# EAGLE design OSO-MISC-20-014-Solar Spike (EAGLE 9.4.2)

## Sheet 1 of 2
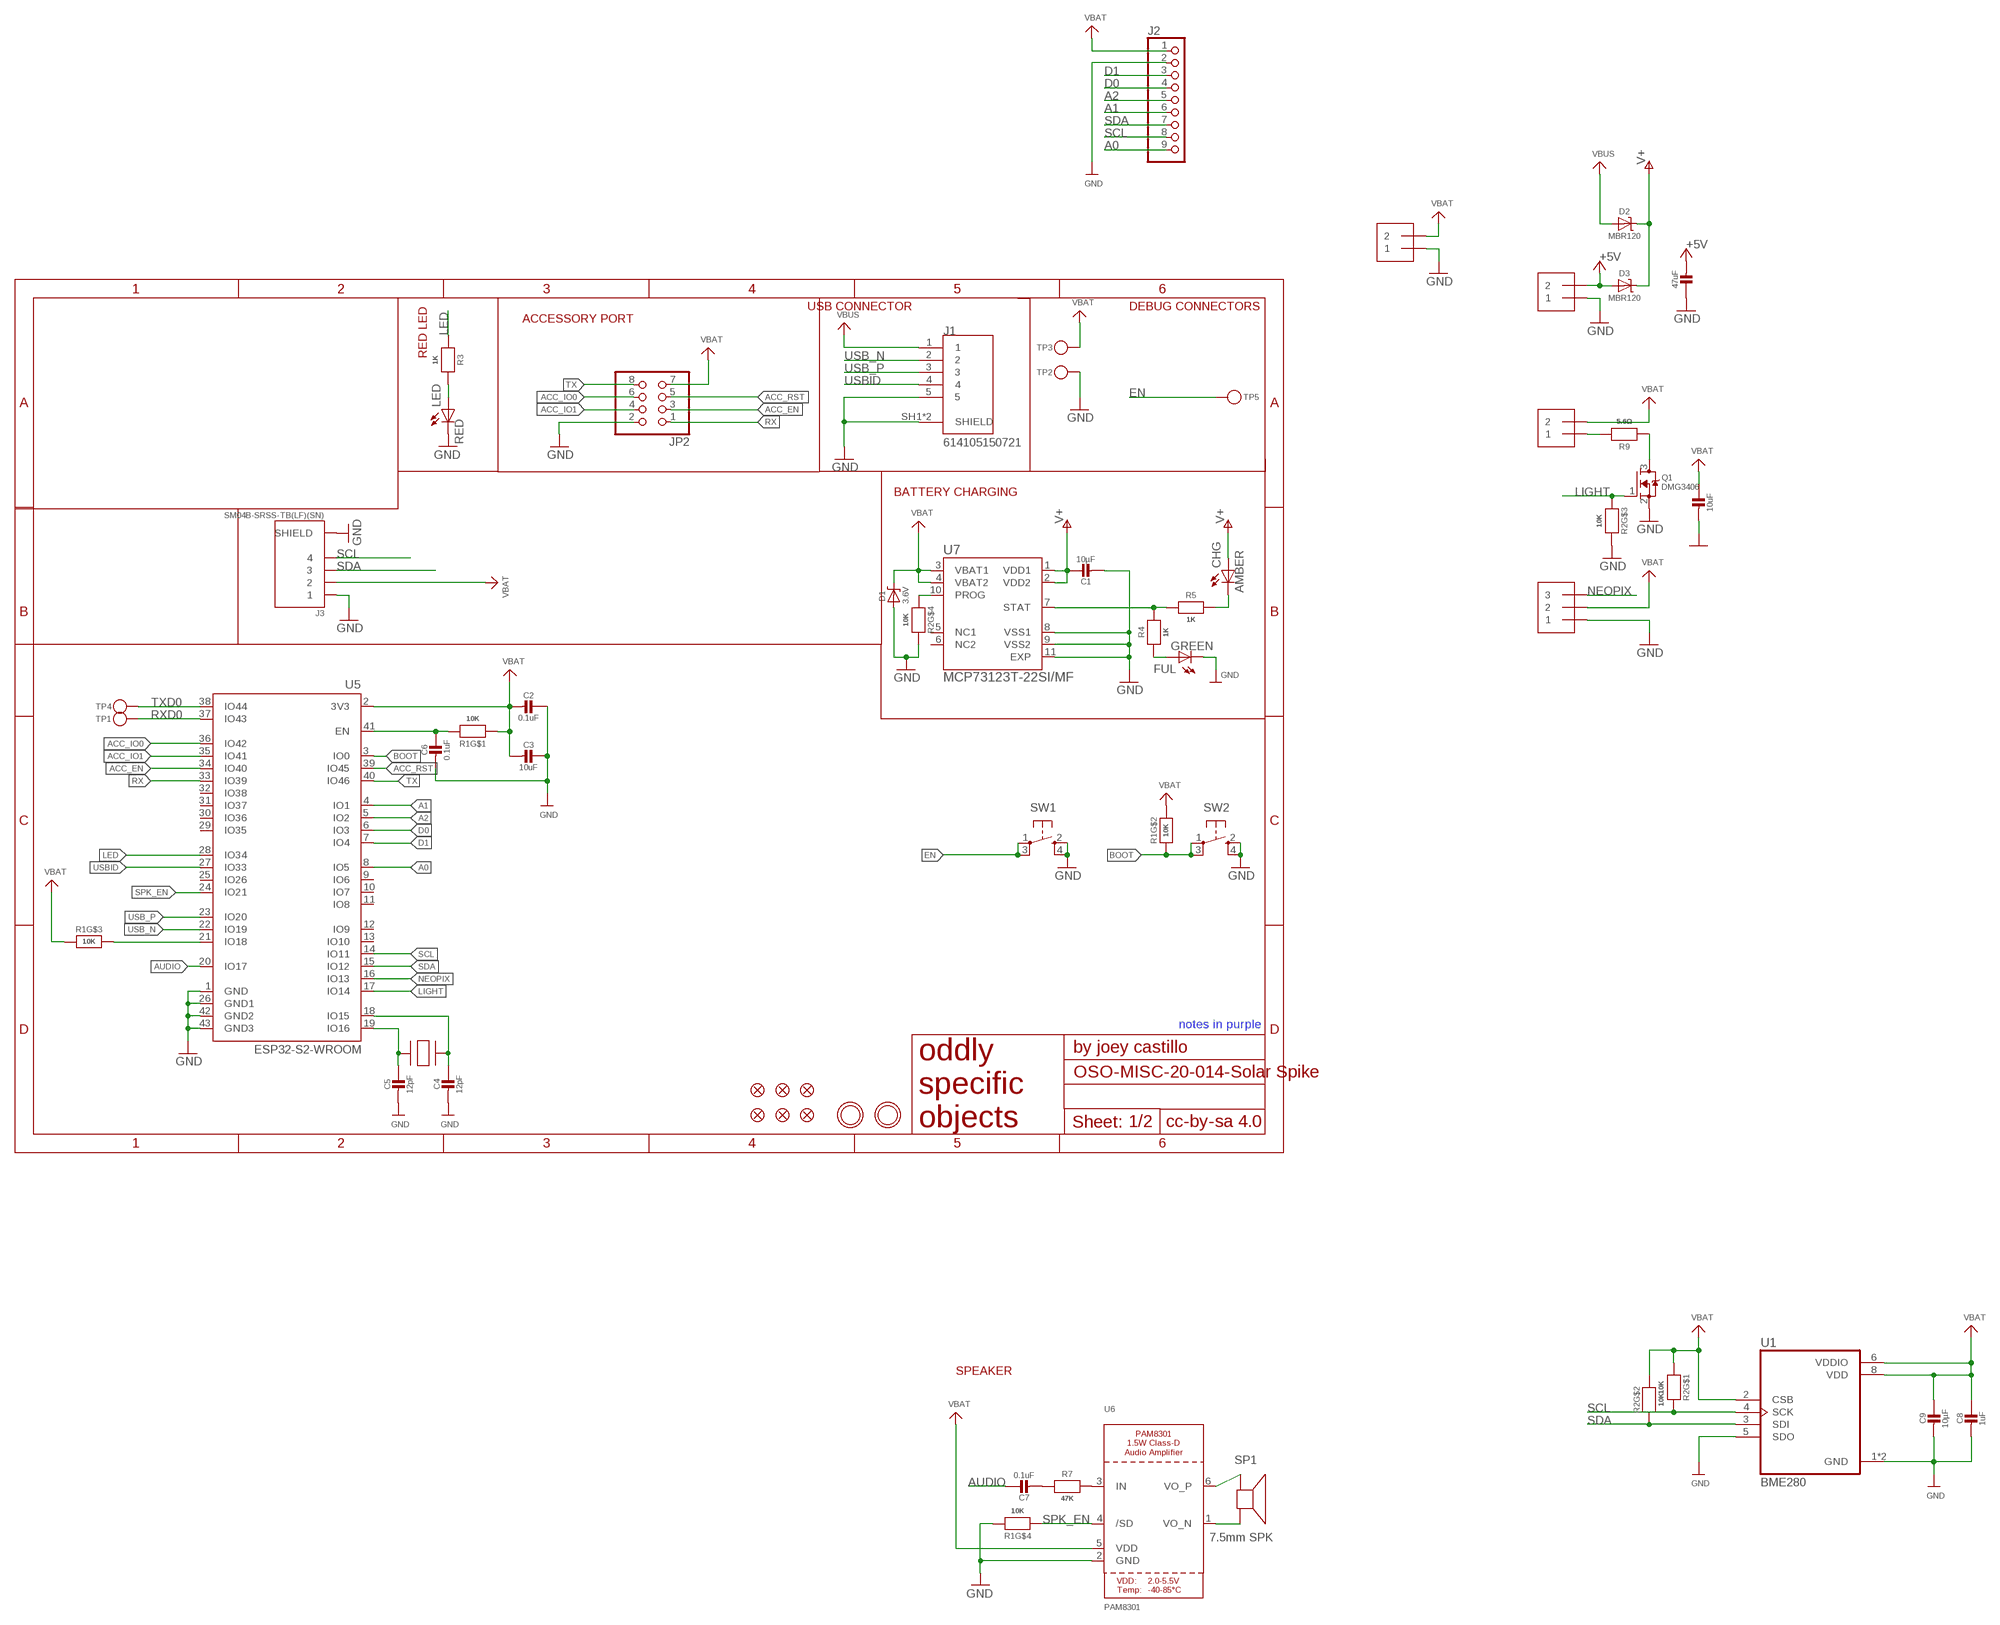
[diagram p0: schematic, sheet 1]

### Parts
BATTERY  1X2-3.5MM  [1X2-3.5MM]
C1  10µF  CAP_CERAMIC0805-NOOUTLINE  [0805-NO]
C2  0.1uF  CAP_CERAMIC0805-NOOUTLINE  [0805-NO]
C3  10uF  CAP_CERAMIC0805-NOOUTLINE  [0805-NO]
C4  12pF  CAP_CERAMIC0805-NOOUTLINE  [0805-NO]
C5  12pF  CAP_CERAMIC0805-NOOUTLINE  [0805-NO]
C6  0.1uF  CAP_CERAMIC0805-NOOUTLINE  [0805-NO]
C7  0.1uF  CAP_CERAMIC0805-NOOUTLINE  [0805-NO]
C8  1uF  CAP_CERAMIC0805-NOOUTLINE  [0805-NO]
C9  10µF  CAP_CERAMIC0805-NOOUTLINE  [0805-NO]
C10  10uF  CAP_CERAMIC0805-NOOUTLINE  [0805-NO]
C11  47uF  CAP_CERAMIC0805-NOOUTLINE  [0805-NO]
CHG  AMBER  LEDCHIPLED_0805  [CHIPLED_0805]
D1  3.6V  DIODE-ZENERSOD123  [SOD-123]
D2  MBR120  DIODE-SCHOTTKYSOD-123  [SOD-123]
D3  MBR120  DIODE-SCHOTTKYSOD-123  [SOD-123]
FID1  FIDUCIAL_1MM  [FIDUCIAL_1MM]
FID2  FIDUCIAL_1MM  [FIDUCIAL_1MM]
FID3  FIDUCIAL_1MM  [FIDUCIAL_1MM]
FID4  FIDUCIAL_1MM  [FIDUCIAL_1MM]
FID5  FIDUCIAL_1MM  [FIDUCIAL_1MM]
FID6  FIDUCIAL_1MM  [FIDUCIAL_1MM]
FUL  GREEN  LEDCHIPLED_0805  [CHIPLED_0805]
J1  614105150721  [WURTH_614105150721]
J2  HEADER-1X9_JSTSH_VERT  [JST_SH9_VERT]
J3  SM04B-SRSS-TB(LF)(SN)  [JST_SM04B-SRSS-TB(LF)(SN)]
JP2  PINHD-2X4SMT  [PINHD_2X4_SMT]
LED  RED  LEDCHIPLED_0805  [CHIPLED_0805]
LIGHT  1X2-3.5MM  [1X2-3.5MM]
NEOPIX  1X3  [1X3-3.5MM]
Q1  DMG3406  MOSFET-NWIDE  [SOT23-WIDE]
R1  10K  EXB-V8V103JV-GOOD  [EXBV8V]
R2  10K  EXB-V8V103JV-GOOD  [EXBV8V]
R3  1K  RESISTOR0805_NOOUTLINE  [0805-NO]
R4  1K  RESISTOR0805_NOOUTLINE  [0805-NO]
R5  1K  RESISTOR0805_NOOUTLINE  [0805-NO]
R7  47K  RESISTOR0805_NOOUTLINE  [0805-NO]
R9  5.6Ω  RESISTOR0805_NOOUTLINE  [0805-NO]
SOLAR  1X2-3.5MM  [1X2-3.5MM]
SP1  7.5mm SPK  SPEAKER_BUZZER5MM  [BUZZER_SMT_5MM]
SW1  SPST_TACT-KMR2  [KMR2]
SW2  SPST_TACT-KMR2  [KMR2]
TP1  TESTPOINTROUND1.5MMNO  [TESTPOINT_ROUND_1.5MM_NO]
TP2  TESTPOINTROUND1.5MMNO  [TESTPOINT_ROUND_1.5MM_NO]
TP3  TESTPOINTROUND1.5MMNO  [TESTPOINT_ROUND_1.5MM_NO]
TP4  TESTPOINTROUND1.5MMNO  [TESTPOINT_ROUND_1.5MM_NO]
TP5  TESTPOINTROUND1.5MMNO  [TESTPOINT_ROUND_1.5MM_NO]
U1  BME280  [PSON65P250X250X100-8N]
U5  ESP32-S2-WROOM  [MODULE_ESP32-S2-WROOM]
U6  PAM8301  [SOT23-6]
U7  MCP73123T-22SI/MF  [SON50P300X300X100-11N]
U$1  MOUNTINGHOLE2.5  [MOUNTINGHOLE_2.5_PLATED]
U$4  MOUNTINGHOLE2.5  [MOUNTINGHOLE_2.5_PLATED]
X1  XTAL-3.2X1.5  [XTAL3215]

### Nets
+5V: C11.2 D3.A SOLAR.2
A0: J2.9 U5.8(IO5)
A1: J2.6 U5.4(IO1)
A2: J2.5 U5.5(IO2)
ACC_EN: JP2.3 U5.34(IO40)
ACC_IO0: JP2.6 U5.36(IO42)
ACC_IO1: JP2.4 U5.35(IO41)
ACC_RST: JP2.5 U5.39(IO45)
AUDIO: C7.1 U5.20(IO17)
BOOT: R1.2 SW2.1(P) SW2.3(P1) U5.3(IO0)
D0: J2.4 U5.6(IO3)
D1: J2.3 U5.7(IO4)
EN: C6.1 R1.8 SW1.1(P) SW1.3(P1) TP5.P$1 U5.41(EN)
GND [gnd]: BATTERY.1 C1.2 C2.1 C3.1 C4.2 C5.2 C6.2 C8.2 C9.2 C10.2 C11.1 D1.A FUL.C J1.5 J1.SH1(SHIELD) J1.SH2(SHIELD) J2.2 J3.1 J3.S1(SHIELD) J3.S2(SHIELD) JP2.2 LED.C NEOPIX.1 Q1.2(S) R1.5 R2.5 R2.6 SOLAR.1 SW1.2(S) SW1.4(S1) SW2.2(S) SW2.4(S1) TP2.P$1 U1.1(GND) U1.5(SDO) U1.7(GND) U5.1(GND) U5.26(GND1) U5.42(GND2) U5.43(GND3) U6.2(GND) U7.8(VSS1) U7.9(VSS2) U7.11(EXP)
LED: R3.1 U5.28(IO34)
LIGHT: Q1.1(G) R2.3 U5.17(IO14)
N$1: R1.6 U5.21(IO18)
N$2: LED.A R3.2
N$3: C7.2 R7.1
N$4: R7.2 U6.3(IN)
N$6: CHG.C R5.2
N$7: FUL.A R4.1
N$9: Q1.3(D) R9.1
N$10: LIGHT.1 R9.2
NEOPIX: NEOPIX.3 U5.16(IO13)
PROG: R2.4 U7.10(PROG)
RX: JP2.1 U5.33(IO39)
RXD0: TP1.P$1 U5.37(IO43)
SCL: J2.8 J3.4 R2.8 U1.4(SCK) U5.14(IO11)
SDA: J2.7 J3.3 R2.7 U1.3(SDI) U5.15(IO12)
SPK_EN: R1.4 U5.24(IO21) U6.4(/SD)
SPK_N: SP1.+ U6.1(VO_N)
SPK_P: SP1.- U6.6(VO_P)
STAT: R4.2 R5.1 U7.7(STAT)
TX: JP2.8 U5.40(IO46)
TXD0: TP4.P$1 U5.38(IO44)
USB_N: J1.2 U5.22(IO19)
USB_P: J1.3 U5.23(IO20)
USBID: J1.4 U5.27(IO33)
V+ [power]: C1.1 CHG.A D2.C D3.C U7.1(VDD1) U7.2(VDD2)
VBAT [power]: BATTERY.2 C2.2 C3.2 C8.1 C9.1 C10.1 D1.C J2.1 J3.2 JP2.7 LIGHT.2 NEOPIX.2 R1.1 R1.3 R1.7 R2.1 R2.2 TP3.P$1 U1.2(CSB) U1.6(VDDIO) U1.8(VDD) U5.2(3V3) U6.5(VDD) U7.3(VBAT1) U7.4(VBAT2)
VBUS [power]: D2.A J1.1
XTAL_N: C5.1 U5.19(IO16) X1.P$2
XTAL_P: C4.1 U5.18(IO15) X1.P$1
Unconnected: U5.9(IO6) U5.10(IO7) U5.11(IO8) U5.12(IO9) U5.13(IO10) U5.25(IO26) U5.29(IO35) U5.30(IO36) U5.31(IO37) U5.32(IO38) U7.5(NC1) U7.6(NC2)

### Notes on the sheet
- RED LED
- USB CONNECTOR | DEBUG CONNECTORS
- ACCESSORY PORT
- BATTERY CHARGING
- notes in purple
- SPEAKER

## Sheet 2 of 2
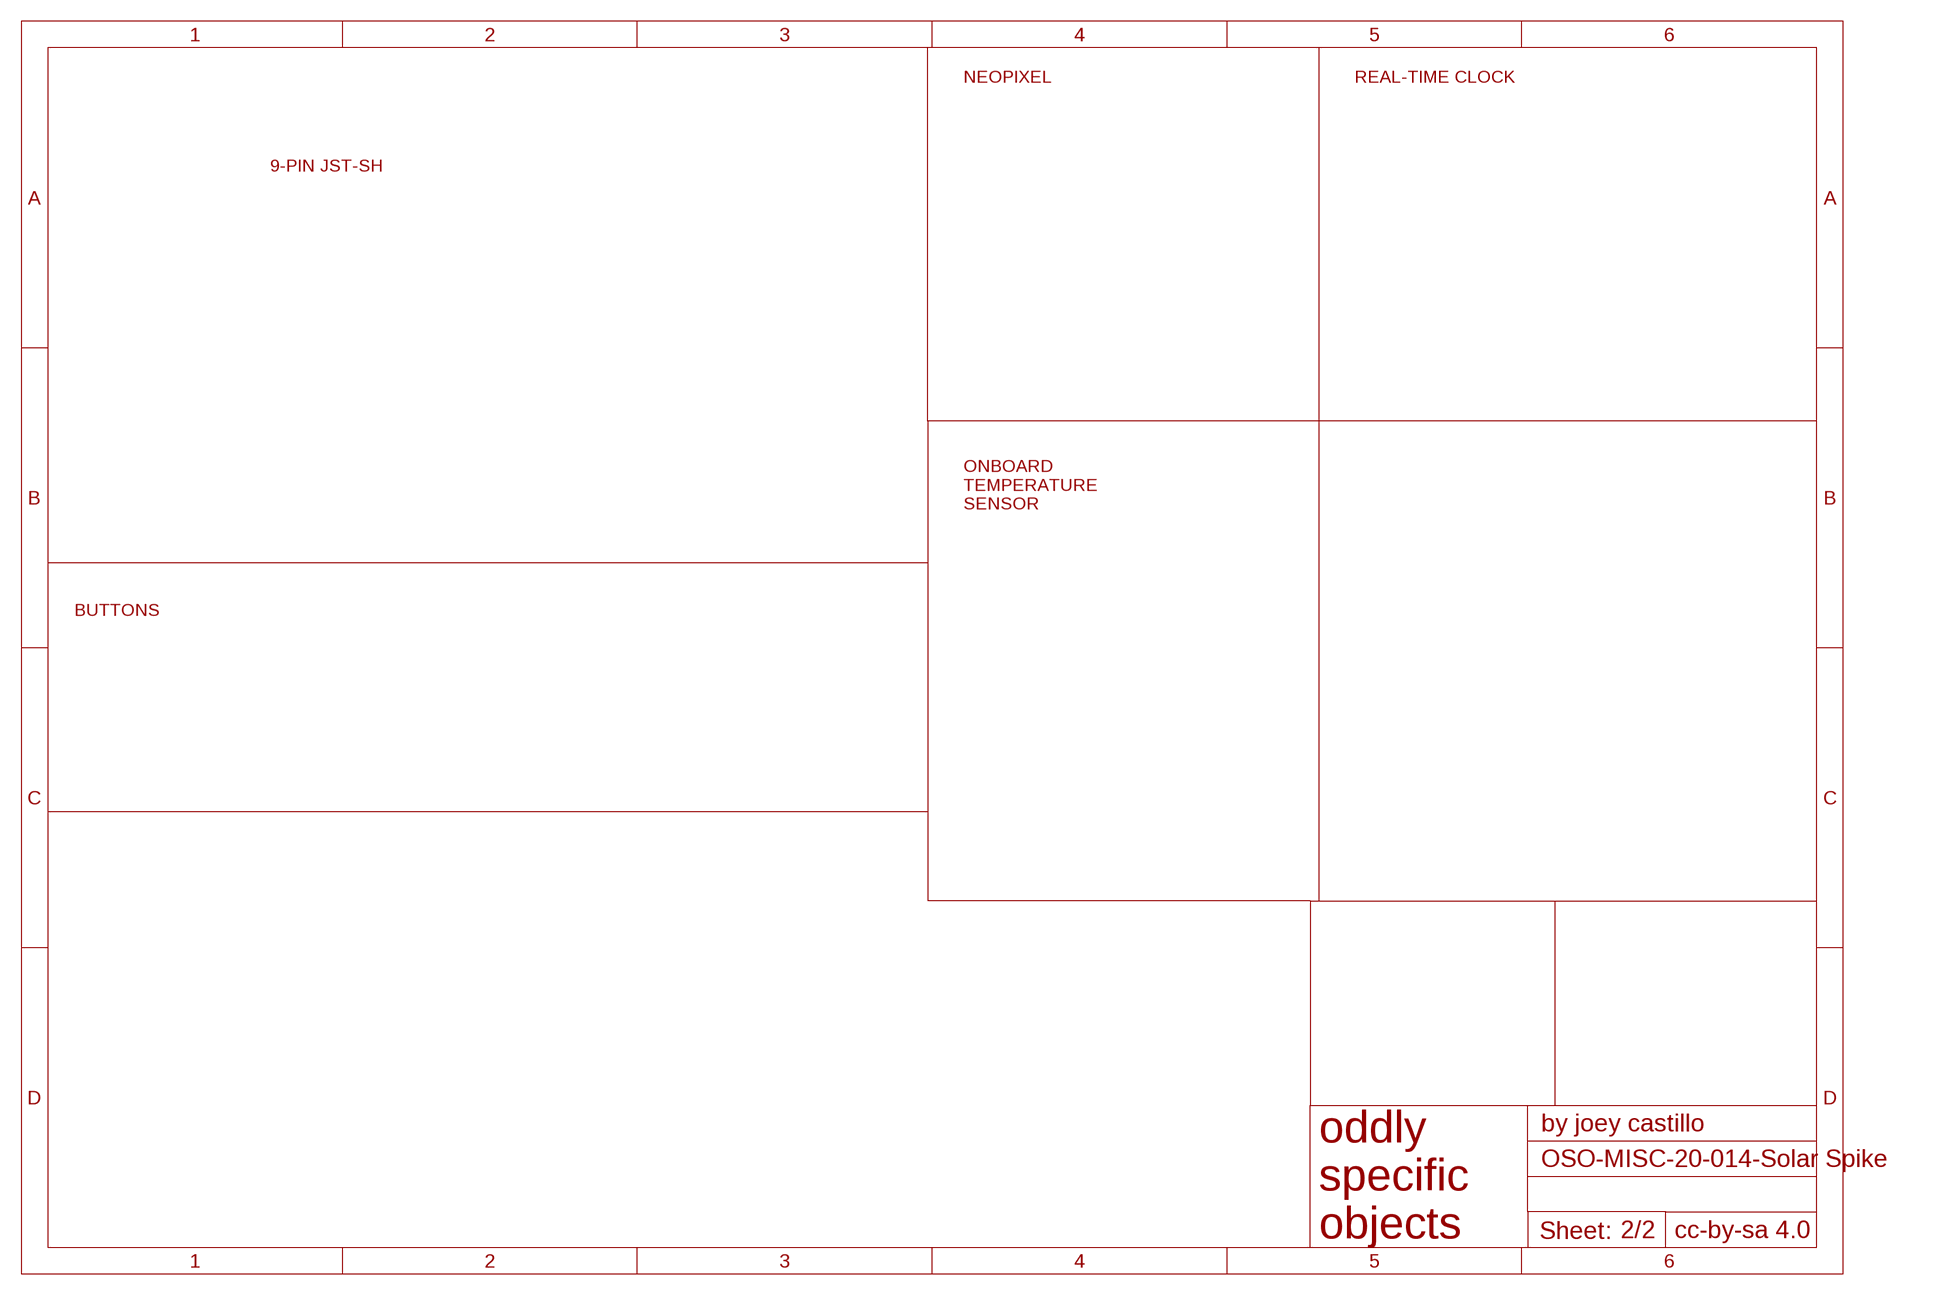
[diagram p1: schematic, sheet 2]

### Notes on the sheet
- NEOPIXEL | REAL-TIME CLOCK
- 9-PIN JST-SH
- ONBOARD
  TEMPERATURE
  SENSOR
- BUTTONS

## Library data of the parts
BATTERY LIGHT SOLAR = My Stuff:1X2: 3.5mm Terminal block http://www.ladyada.net/library/pcb/eaglelibrary.html
C1-C11 = microbuilder:CAP_CERAMIC: Ceramic Capacitors For new designs, use the packages preceded by an '_' character since they are more reliable: The following footprints should be used on most boards: _0402 - Standard footprint for regular board layouts _0603 - Standard footprint for regular board layouts _0805 - Standard footprint for regular board layouts _1206 - Standard footprint for regular board layouts For extremely tight-pitch boards where space is at a premium, the following 'micro-pitch' footprints can be used (smaller pads, no silkscreen outline, etc.): _0402MP - Micro-pitch footprint for very dense/compact boards _0603MP - Micro-pitch footprint for very dense/compact boards _0805MP - Micro-pitch footprint for very dense/compact boards _1206MP - Micro-pitch footprint for very dense/compact boards
CHG FUL LED = adafruit:LED: LED OSRAM: - CHIPLED LG R971, LG N971, LY N971, LG Q971, LY Q971, LO R971, LY R971 LH N974, LH R974 LS Q976, LO Q976, LY Q976 LO Q996 - Hyper CHIPLED LW Q18S LB Q993, LB Q99A, LB R99A - SideLED LS A670, LO A670, LY A670, LG A670, LP A670 LB A673, LV A673, LT A673, LW A673 LH A674 LY A675 LS A676, LA A676, LO A676, LY A676, LW A676 LS A679, LY A679, LG A679 - Hyper Micro SIDELED® LS Y876, LA Y876, LO Y876, LY Y876 LT Y87S - SmartLED LW L88C, LW L88S LB L89C, LB L89S, LG L890 LS L89K, LO L89K, LY L89K LS L896, LA L896, LO L896, LY L896 - TOPLED LS T670, LO T670, LY T670, LG T670, LP T670 LSG T670, LSP T670, LSY T670, LOP T670, LYG T670 LG T671, LOG T671, LSG T671 LB T673, LV T673, LT T673, LW T673 LH T674 LS T676, LA T676, LO T676, LY T676, LB T676, LH T676, LSB T676, LW T676 LB T67C, LV T67C, LT T67C, LS T67K, LO T67K, LY T67K, LW E67C LS E67B, LA E67B, LO E67B, LY E67B, LB E67C, LV E67C, LT E67C LW T67C LS T679, LY T679, LG T679 LS T770, LO T770, LY T770, LG T770, LP T770 LB T773, LV T773, LT T773, LW T773 LH T774 LS E675, LA E675, LY E675, LS T675 LS T776, LA T776, LO T776, LY T776, LB T776 LHGB T686 LT T68C, LB T68C - Hyper Mini TOPLED® LB M676 - Mini TOPLED Santana® LG M470 LS M47K, LO M47K, LY M47K Source: http://www.osram.convergy.de/
D1 = microbuilder:DIODE-ZENER: Zener Diode SMA: 30V 1W Zener Diode, 1.2Vf - Digikey: SMAZ30-FDICT-ND
D2 D3 = microbuilder:DIODE-SCHOTTKY
FID1-FID6 = microbuilder:FIDUCIAL: Fiducial Alignment Points Various fiducial points for machine vision alignment.; BOM: EXCLUDE
J1 = 614105150721:614105150721: Vertical Through Hole; sion 2.0 Micro USB Connector Socket; DESCRIPTION: USB - micro B USB 2.0 Receptacle Connector 5 Position Through Hole; DIGIKEY-PURCHASE-URL: https://snapeda.com/shop?store=DigiKey&id=1118291; MF: Wurth Electronics; MP: 614105150721; PACKAGE: None
J2 = My Stuff:HEADER-1X9: PIN HEADER
J3 = SM04B-SRSS-TB_LF__SN_:SM04B-SRSS-TB(LF)(SN): SH Series 1.0 mm Pitch 2 Position Single Row Side Entry Shrouded Header; DESCRIPTION: SH Series 1.0 mm Pitch 2 Position Single Row Side Entry Shrouded Header; DIGI-KEY_PART_NUMBER: 455-1804-1-ND; DIGI-KEY_PURCHASE_URL: https://www.digikey.com/product-detail/en/jst-sales-america-inc/SM04B-SRSS-TB_LF__SN_/455-1804-1-ND/926875?utm_source=snapeda&utm_medium=aggregator&utm_campaign=symbol; MF: JST Sales; MP: SM04B-SRSS-TB_LF__SN_; PACKAGE: None
JP2 = My Stuff:PINHD-2X4: PIN HEADER
NEOPIX = My Stuff:1X3: 3.5mm Terminal block http://www.ladyada.net/library/pcb/eaglelibrary.html
Q1 = microbuilder:MOSFET-N: N-Channel Mosfet LEGEND VDS: Voltage Drain-Source ID: Drain Current RDS(ON): Drain-Source On-State Resistance VGS(TH): Gate-Source Threshold Voltage CISS: Drain-Source Input Capacitance SOT-23 Name VDS ID RDS(ON) VGS(TH) CISS Order Number 2N7002E 60V 260mA 2.5 Ohm 2.5V @ 250uA 26.7pF @ 25V 2N7002ET1GOSTR-ND BSH103 30V 850mA 400 mOhm 400mV @ 1mA 83pF @ 24V BSH103,235-ND BSS138 60V 320mA 1.6 Ohm 1.5V @ 250uA 50pF @ 10V Mouser: 771-BSS138PW115 DMN2075U-7 20V 4.2A 38 mOhm 1V @ 250 uA 594.3pF @ 10V DMN2075U-7DICT-ND * BSS138 good choice for I2C level-shifting POWERPAK 1212-8 Name VDS ID RDS(ON) VGS(TH) CISS Order Number Si7308DN 60V 6A 58 mOhm 3V @ 250uA 665pF @ 15V SI7308DN-T1-E3CT-ND
R1 R2 = resistor array:EXB-V8V103JV-GOOD; MANUFACTURER_PART_NUMBER: EXBV8V103JV; VENDOR: Panasonic
R3-R5 R7 R9 = microbuilder:RESISTOR: Resistors For new designs, use the packages preceded by an '_' character since they are more reliable: The following footprints should be used on most boards: _0402 - Standard footprint for regular board layouts _0603 - Standard footprint for regular board layouts _0805 - Standard footprint for regular board layouts _1206 - Standard footprint for regular board layouts For extremely tight-pitch boards where space is at a premium, the following 'micro-pitch' footprints can be used (smaller pads, no silkscreen outline, etc.): _0402MP - Micro-pitch footprint for very dense/compact boards _0603MP - Micro-pitch footprint for very dense/compact boards _0805MP - Micro-pitch footprint for very dense/compact boards _1206MP - Micro-pitch footprint for very dense/compact boards
SP1 = microbuilder:SPEAKER: SPEAKER Source: Buerklin Added PS12 (for part # PS1240 piezo) http://www.ladyada.net/library/pcb/eaglelibrary.html
SW1 SW2 = adafruit:SPST_TACT: SMT 6mm switch, EVQQ2 series http://www.ladyada.net/library/eagle
TP1-TP5 = microbuilder:TESTPOINT: Test Point Various test points for characterisation and PCB testing TESTPOINT_SMT - Compact Surface Mount Test Point [Digikey: 5016KTR-ND]
U1 = BME280:BME280: DIGITAL HUMIDITY, PRESSURE AND TEMPERATURE SENSOR * Digital interface I²C (up to 3.4 MHz) and SPI (3 and 4 wire, up to 10 MHz)* Supply voltage VDD main supply voltage range: 1.71 V to 3.6 V*VDDIO interface voltage range: 1.2 V to 3.6 V Operating range -40…+85 °C, 0…100 % rel. humidity, 300…1100 hPa The library has been designed by Richard Magdycz <https://www.facebook.com/groups/eaglecadsoftUK>; DESCRIPTION: Humidity Temperature Sensor 0 ~ 100% RH I²C, SPI ±3% 1s Surface Mount; MF: Bosch; MP: BME280; PACKAGE: LGA-8 Bosch
U5 = ESP32-S2-WROOM:ESP32-S2-WROOM: ESP32-S2-WROOM and ESP32-S2-WROOM-I Created by a human, so please check as no responsibility accepted for any errors or omissions. (Drawn by Dave Williams | G8PUO | DitroniX); AVAILABILITY: Unavailable; DESCRIPTION: WiFi 802.11b/g/n Transceiver Module 2.4GHz Antenna Not Included Surface Mount; MF: Espressif Systems; MP: ESP32-S2-WROOM; PACKAGE: VFQFN-56 Espressif Systems; PRICE: None
U6 = microbuilder:PAM8301
U7 = MCP73123T-22SI_MF:MCP73123T-22SI/MF: Single cell, 6.5V OVP LiFePO4 battery charger, 3.6V regulation10 DFN 3x3x0.9mm T/R; DESCRIPTION: Charger IC Lithium Iron Phosphate 10-DFN (3x3); DIGI-KEY_PART_NUMBER: MCP73123T-22SI/MFCT-ND; MF: Microchip; MP: MCP73123T-22SI/MF; PACKAGE: DFN-10 Microchip
U$1 U$4 = microbuilder:MOUNTINGHOLE: Mounting Hole For #2 screws (0.086"/2.18mm width, 0.094"/2.4mm hole) use 2.5mm; BOM: EXCLUDE
X1 = adafruit:XTAL: Low cost SMT crystals, no capacitors included http://www.ladyada.net/library/eagle

## Net classes
1 power: width 0.254 mm, drill 0.254 mm
2 gnd: width 0.254 mm, drill 0.254 mm

## Board
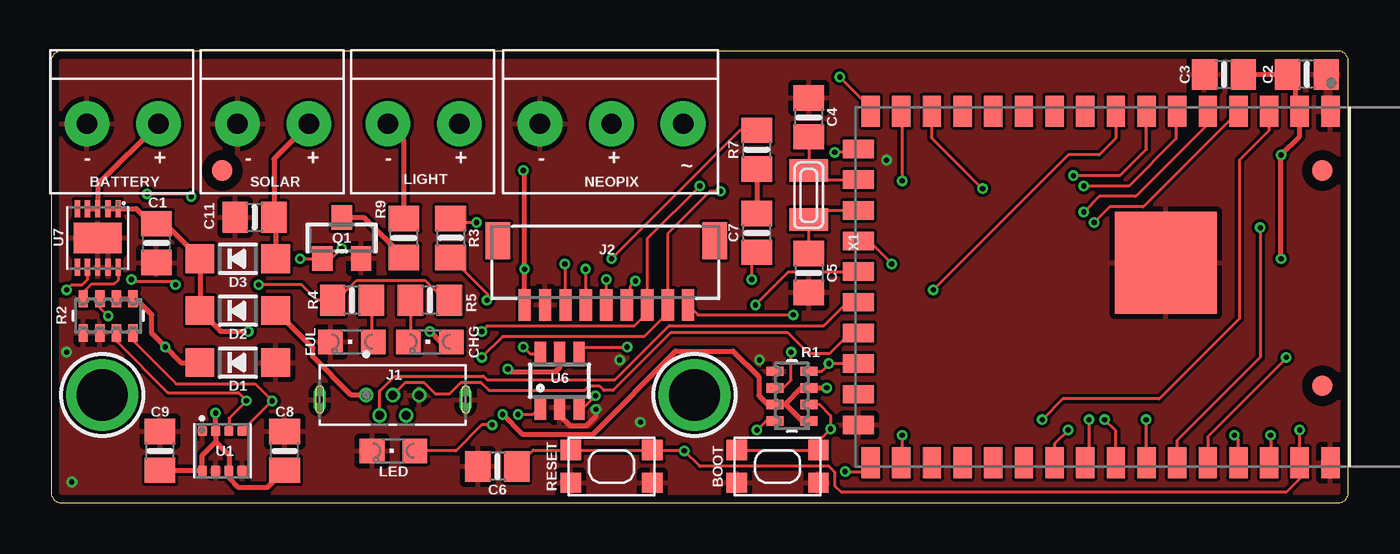
[diagram p2: board, top side]
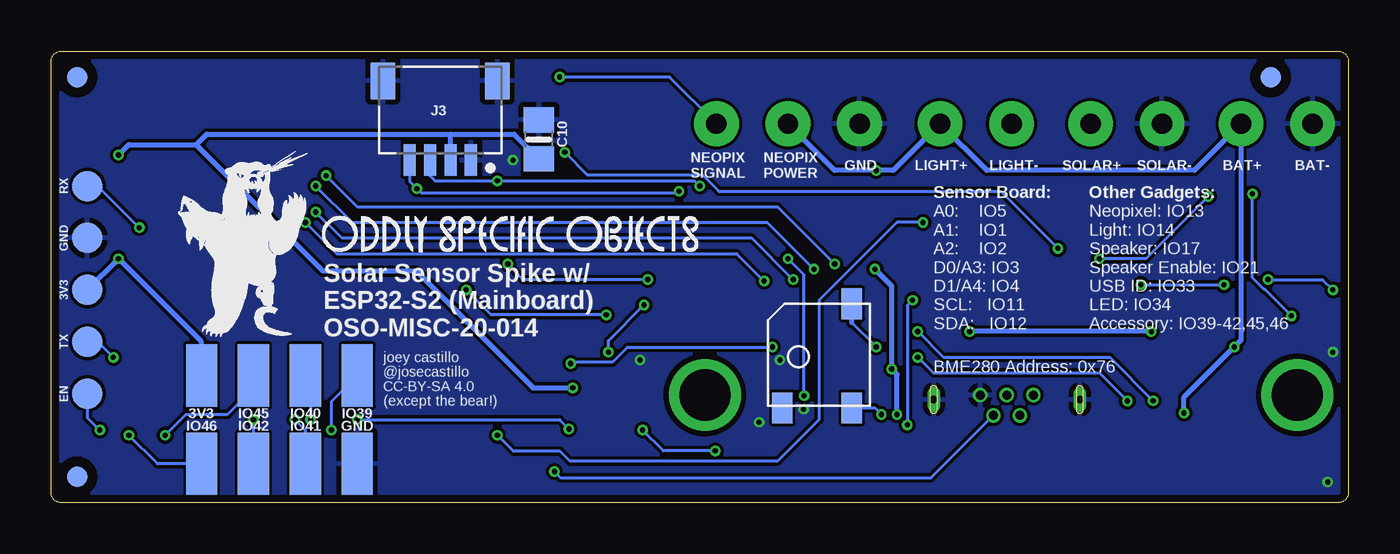
[diagram p3: board, bottom side, seen from below]

Size 63.5 x 22.1 mm. Coordinates in mm from the lower left corner, seen from the top.
Outline: 0.51,0 62.99,0 arc90 63.5,0.51 63.5,21.59 arc90 62.99,22.1 0.51,22.1 arc90 0,21.59 0,0.51 arc90 0.51,0
Copper layers (1*16): Top 0.035559375mm / dielectric 1.6mm / Bottom 0.035559375mm
Design rules "oshpark-2layer *": minimum track width 6mil, minimum drill 10mil, track to track 6mil, track to pad 6mil, pad to pad 6mil, via to via 6mil, smd to smd 6mil, copper to edge 15mil, drill to drill 6mil, minimum pad ring 5mil, minimum via ring 5mil, stop-mask expansion 2.5mil, vias tented up to drill 12mil, thermal gap 10mil

### Footprints (pad centres in the part's own frame; a part is rotated, then mirrored left to right if it is on the bottom)
1X2-3.5MM = drill 1 pad 2.184: 1 1.8,0; 2 -1.7,0
0805-NO = smd 1.24 x 1.5: 1 -0.95,0; 2 0.95,0
CHIPLED_0805 = smd 1.2 x 1.2: A 0,-1.05; C 0,1.05
SOD-123 = smd 1.4 x 1.4: A 1.85,0; C -1.85,0
FIDUCIAL_1MM = smd 1 x 1: 1 0,0
WURTH_614105150721 = drill 0.44: 1 -1.3,0; 2 -0.65,-1; 3 0,0; 4 0.65,-1; 5 1.3,0 | drill 0.35 long: SH1 -3.575,-0.22; SH2 3.575,-0.22
JST_SH9_VERT = smd 0.6 x 1.55: 1 4,2.514; 2 3,2.514; 3 2,2.514; 4 1,2.514; 5 0,2.514; 6 -1,2.514; 7 -2,2.514; 8 -3,2.514; 9 -4,2.514 | smd 1.2 x 1.8: MT1 -5.3,-0.624; MT2 5.3,-0.624
JST_SM04B-SRSS-TB(LF)(SN) = smd 0.6 x 1.55: 1 -1.5,0; 2 -0.5,0; 3 0.5,0; 4 1.5,0 | smd 1.2 x 1.8: S1 -2.8,-3.875; S2 2.8,-3.875
PINHD_2X4_SMT = smd 1.524 x 3.048: 1 -3.81,-2.159; 2 -3.81,2.159; 3 -1.27,-2.159; 4 -1.27,2.159; 5 1.27,-2.159; 6 1.27,2.159; 7 3.81,-2.159; 8 3.81,2.159
1X3-3.5MM = drill 1 pad 2.184: 1 3.5,0; 2 0,0; 3 -3.5,0
SOT23-WIDE = smd 1 x 1.2: 1 -0.95,-1; 2 0.95,-1; 3 0,1
EXBV8V = smd 0.838 x 0.457: 1 -0.838,1.219; 2 -0.838,0.406; 3 -0.838,-0.406; 4 -0.838,-1.219; 5 0.838,-1.219; 6 0.838,-0.406; 7 0.838,0.406; 8 0.838,1.219
BUZZER_SMT_5MM = smd 1.5 x 1: + -2.6,-1.6; - 2.5,-1.6; MT -2.6,1.8
KMR2 = smd 1 x 1: 1 2,0.8; 2 2,-0.8; 3 -2,0.8; 4 -2,-0.8
TESTPOINT_ROUND_1.5MM_NO = smd 1.5 x 1.5: P$1 0,0
PSON65P250X250X100-8N = smd 0.49 x 0.45: 1 0.97,0.975; 2 0.97,0.325; 3 0.97,-0.325; 4 0.97,-0.975; 5 -0.97,-0.975; 6 -0.97,-0.325; 7 -0.97,0.325; 8 -0.97,0.975
MODULE_ESP32-S2-WROOM = smd 1.5 x 0.9: 1 0.4,23.5; 2 0.4,22; 3 0.4,20.5; 4 0.4,19; 5 0.4,17.5; 6 0.4,16; 7 0.4,14.5; 8 0.4,13; 9 0.4,11.5; 10 0.4,10; 11 0.4,8.5; 12 0.4,7; 13 0.4,5.5; 14 0.4,4; 15 0.4,2.5; 16 0.4,1; 27 17.6,1; 28 17.6,2.5; 29 17.6,4; 30 17.6,5.5; 31 17.6,7; 32 17.6,8.5; 33 17.6,10; 34 17.6,11.5; 35 17.6,13; 36 17.6,14.5; 37 17.6,16; 38 17.6,17.5; 39 17.6,19; 40 17.6,20.5; 41 17.6,22; 42 17.6,23.5 | smd 0.9 x 1.5: 17 2.25,0.4; 18 3.75,0.4; 19 5.25,0.4; 20 6.75,0.4; 21 8.25,0.4; 22 9.75,0.4; 23 11.25,0.4; 24 12.75,0.4; 25 14.25,0.4; 26 15.75,0.4 | smd 5 x 5: 43 7.81,15.45
SOT23-6 = smd 0.55 x 1.2: 1 -0.95,-1.3; 2 0,-1.3; 3 0.95,-1.3; 4 0.95,1.3; 5 0,1.3; 6 -0.95,1.3
SON50P300X300X100-11N = smd 0.84 x 0.26: 1 -1.435,1; 2 -1.435,0.5; 3 -1.435,0; 4 -1.435,-0.5; 5 -1.435,-1; 6 1.435,-1; 7 1.435,-0.5; 8 1.435,0; 9 1.435,0.5; 10 1.435,1 | smd 1.5 x 2.35: 11 0,0
MOUNTINGHOLE_2.5_PLATED = drill 2.5 pad 3.2: P$1 0,0
XTAL3215 = smd 1.1 x 1.9: P$1 1.2,0; P$2 -1.2,0

### Placement (x,y rotation side)
BATTERY  3.56,18.54 180 top
C1  5.16,12.7 270 top
C2  61.47,20.95 180 top
C3  57.4,20.95 0 top
C4  37.08,18.86 90 top
C5  37.08,11.24 270 top
C6  21.84,1.78 180 top
C7  34.54,13.21 90 top
C8  11.43,2.54 90 top
C9  5.33,2.54 90 top
C10  39.62,17.78 90 bottom
C11  9.96,13.97 0 top
CHG  18.54,7.87 90 top
D1  9.14,6.86 0 top
D2  9.14,9.4 0 top
D3  9.14,11.94 0 top
FID1  62.23,5.71 90 top
FID2  62.23,16.26 270 top
FID3  8.38,16.26 90 top
FID4  3.81,20.83 270 bottom
FID5  62.23,1.27 0 bottom
FID6  62.23,20.83 0 bottom
FUL  14.73,7.87 90 top
J1  16.72,5.27 0 top
J2  27.18,12.19 180 top
J3  44.45,16.76 180 bottom
JP2  52.32,4.06 180 bottom
LED  16.76,2.54 90 top
LIGHT  18.29,18.54 180 top
NEOPIX  27.43,18.54 180 top
Q1  14.22,12.95 0 top
R1  36.27,5.21 180 top
R2  2.79,9.14 270 top
R3  19.56,12.95 270 top
R4  14.73,9.91 180 top
R5  18.54,9.91 180 top
R7  34.54,17.27 90 top
R9  17.27,12.95 90 top
SOLAR  10.92,18.54 180 top
SP1  25.91,7.24 90 bottom
SW1  27.43,1.78 0 top
SW2  35.56,1.78 0 top
TP1  61.72,15.49 270 bottom
TP2  61.72,12.95 270 bottom
TP3  61.72,10.41 270 bottom
TP4  61.72,7.87 270 bottom
TP5  61.72,5.33 270 bottom
U1  8.38,2.54 90 top
U5  39.12,19.56 270 top
U6  24.89,5.97 0 top
U7  2.29,12.95 270 top
U$1  31.5,5.27 90 top
U$4  2.5,5.27 90 top
U$15  [OSO_BEAR_250X360MIL_1000DPI]  54.1,12.7 0 bottom
U$31  [OSO_WORDMARK_ONELINE_725MIL_1000DPI]  50.29,12.19 0 bottom
X1  37.08,15.05 90 top

### Tracks (layer width: path | path; a pad name or v marks a point on that pad's centre or on a via)
+5V
  Top 0.254: SOLAR.2 10.91,16.83 C11.2 10.99,13.88 D3.A
A0  (via drill 0.25)
  Top 0.152: J2.9 31.66,9.19 v36.32,9.19 | v43.18,10.41 49.78,17.02 51.31,17.02 52.12,17.83 U5.8
  Bottom 0.152: v36.32,9.19 41.96,9.19 v43.18,10.41
A1  (via drill 0.25)
  Top 0.152: U5.4 58.12,19.14 53.46,14.48 51.82,14.48 v51.05,13.72 | v28.6,10.85 28.35,10.59 28.35,9.85 J2.6
  Bottom 0.152: v51.05,13.72 49.53,12.19 29.95,12.19 v28.6,10.85
A2  (via drill 0.25)
  Top 0.152: J2.5 v27.18,10.92 | v50.55,14.22 51.31,14.99 53.09,14.99 56.62,18.52 U5.5
  Bottom 0.152: v50.55,14.22 49.28,12.95 29.21,12.95 v27.18,10.92
ACC_EN  (via drill 0.25)
  Top 0.152: v50.8,4.06 50.8,2.14 U5.34
  Bottom 0.152: JP2.3 50.8,5.97 v50.8,4.06
ACC_IO0  (via drill 0.25)
  Top 0.152: v53.59,4.06 53.59,1.98 U5.36
  Bottom 0.152: JP2.6 v53.59,4.06
ACC_IO1  (via drill 0.25)
  Top 0.152: U5.35 52.12,3.51 v51.56,4.06
  Bottom 0.152: v51.56,4.06 51.05,3.56 JP2.4
ACC_RST  (via drill 0.25)
  Top 0.152: U5.39 58.12,3.1 v57.91,3.3
  Bottom 0.152: v57.91,3.3 56.9,4.32 54.86,4.32 53.59,5.59 JP2.5
AUDIO  (via drill 0.25)
  Top 0.152: C7.1 34.29,12 v34.29,10.92 | v41.15,11.68 40.02,12.81 U5.20
  Bottom 0.152: v34.29,10.92 40.39,10.92 v41.15,11.68
BOOT  (via drill 0.25)
  Top 0.152: SW2.3 SW2.1 37.56,3.02 v38.15,3.61 38.15,4.27 37.61,4.81 R1.2 | U5.3 59.62,18.21 58.17,16.76 58.17,9.01 54.24,5.08 49.53,5.08 v48.51,4.06
  Bottom 0.152: v38.15,3.61 38.61,4.06 v48.51,4.06
D0  (via drill 0.25)
  Top 0.152: U5.6 55.06,19.1 55.06,17.8 52.74,15.49 v50.55,15.49 | v26.16,11.43 26.16,9.69 J2.4
  Bottom 0.152: v26.16,11.43 28.45,13.72 48.77,13.72 v50.55,15.49
D1  (via drill 0.25)
  Top 0.152: J2.3 25.18,11.65 v25.15,11.68 | v50.04,16 52.32,16 53.62,17.29 U5.7
  Bottom 0.152: v25.15,11.68 27.94,14.48 48.51,14.48 v50.04,16
EN  (via drill 0.25)
  Top 0.152: v61.11,3.56 v61.12,3.55 U5.41 61.12,1.17 60.45,0.51 38.69,0.51 38.38,0.82 38.38,1.48 38.08,1.78 31.75,1.78 v30.99,2.54 30.95,2.58 SW1.1 SW1.3 23.59,2.58 C6.1 | v34.54,3.56 34.98,4 R1.8
  Bottom 0.152: TP5.P$1 61.72,4.17 v61.11,3.56 | v30.99,2.54 33.53,2.54 v34.54,3.56
GND  (via drill 0.25)
  Top 0.254: U6.2 24.89,4.27 25.4,3.76 26.21,3.76 26.67,4.23 v26.67,4.57
  other vias: 0.76,7.37 1.02,1.02 40.89,16.76 34.67,6.99 28.84,3.94 27.83,6.99
  pour Top: 63.75,-0.02 63.75,22.1 0.02,22.1 0.02,-0.02
  pour Bottom: -0.25,-0.02 -0.25,22.1 63.48,22.1 63.48,-0.02
LED  (via drill 0.25)
  Top 0.152: R3.1 19.75,13.72 v20.83,13.72 | v41.66,3.3 41.66,2 U5.28
  Bottom 0.152: v20.83,13.72 22.1,13.72 25.91,9.91 25.91,4.06 27.94,2.03 38.1,2.03 38.58,2.52 40.87,2.52 v41.66,3.3
LIGHT  (via drill 0.25)
  Top 0.152: 13.29,11.94 Q1.1 | R2.3 2.39,9.55 v2.79,9.14 | v4.7,15.11 6.73,15.11 v6.86,14.99 | v12.19,11.94 13.29,11.94 | U5.17 39.35,17.14 v38.35,17.14 | v14.22,12.45 13.72,11.94 13.29,11.94
  Bottom 0.152: v2.79,9.14 4.09,10.44 4.14,10.44 4.7,11 v4.7,15.11 | v6.86,14.99 9.91,11.94 v12.19,11.94 | v38.35,17.14 37.26,16.05 31.63,16.05 30.81,15.24 17.02,15.24 v14.22,12.45
N$1  (via drill 0.25)
  Top 0.152: v34.48,9.68 36.09,11.29 39.5,11.29 U5.21 | R1.6 35.85,5.62 36.22,5.99 v36.22,7.37
  Bottom 0.152: v36.22,7.37 36.22,7.94 v34.48,9.68
N$2  (via drill 0.25)
  Top 0.152: R3.2 21.34,10.23 v21.34,9.91 | v21.59,3.81 21.08,3.81 19.81,2.54 LED.A
  Bottom 0.152: v21.34,9.91 21.59,9.65 v21.59,3.81
N$3
  Top 0.254: R7.1 C7.2
N$4  (via drill 0.25)
  Top 0.152: R7.2 33.72,18.22 v27.43,11.94 | U6.3 26.08,4.67 v26.64,5.23
  Bottom 0.152: v26.64,5.23 26.64,11.15 v27.43,11.94
N$6
  Top 0.152: R5.2 17.59,7.97 CHG.C
N$7
  Top 0.152: R4.1 15.68,7.97 FUL.A
N$9
  Top 0.254: R9.1 15.32,13.95 Q1.3
N$10
  Top 0.254: R9.2 17.27,17.76 LIGHT.1
NEOPIX  (via drill 0.25)
  Top 0.152: v38.61,20.83 40.12,19.32 U5.16
  Bottom 0.152: NEOPIX.3 33.22,20.83 v38.61,20.83
PROG
  Top 0.152: R2.4 1.57,10.29 1.99,10.71 3.09,10.71 3.3,10.92 3.3,11.5 U7.10
RX  (via drill 0.25)
  Top 0.152: v49.78,3.56 49.12,2.89 U5.33
  Bottom 0.152: JP2.1 49.78,4.95 v49.78,3.56
RXD0  (via drill 0.25)
  Top 0.152: U5.37 55.12,3.05 59.18,7.11 v59.18,13.46
  Bottom 0.152: v59.18,13.46 61.21,15.49 TP1.P$1
SCL  (via drill 0.25)
  Top 0.152: v32.77,15.24 32.26,15.24 30.18,13.16 J2.8 30.18,9.28 29.03,8.13 22.1,8.13 v21.08,7.11 | U1.4 v10.82,4.98 9.98,5.82 6.12,5.82 4.01,7.92 R2.8 | v45.59,15.37 43.12,17.84 U5.14
  Bottom 0.152: J3.4 45.95,15.72 v45.59,15.37 45.57,15.37 45.36,15.16 32.84,15.16 v32.77,15.24 | v21.08,7.11 20.32,6.35 12.19,6.35 v10.82,4.98
SDA  (via drill 0.25)
  Top 0.152: v31.75,15.49 29.18,12.92 J2.7 29.18,9.28 28.53,8.64 21.34,8.64 v21.08,8.38 | U1.3 8.71,4.13 v9.56,4.99 9.17,5.38 5.71,5.38 3.2,7.89 R2.7 | U5.15 41.66,19.12 v41.66,15.75
  Bottom 0.152: J3.3 44.95,15.99 44.7,15.75 v41.66,15.75 32,15.75 v31.75,15.49 | v21.08,8.38 19.81,7.11 11.68,7.11 v9.56,4.99
SPK_EN  (via drill 0.25)
  Top 0.152: U5.24 38.1,6.81 | 38.1,6.81 v38.07,6.81 | R1.4 37.73,6.43 38.1,6.81 | U6.4 25.84,7.52 25.93,7.62 v28.19,7.62
  Bottom 0.152: v38.07,6.81 37.99,6.88 36.02,6.88 35.29,7.62 v28.19,7.62
SPK_N  (via drill 0.25)
  Top 0.152: v22.86,4.32 23.59,4.32 U6.1
  Bottom 0.152: SP1.+ 23.18,4.64 v22.86,4.32
SPK_P  (via drill 0.25)
  Top 0.152: U6.6 23.46,7.27 v23.11,7.62
  Bottom 0.152: v23.11,7.62 24.31,8.81
  Bottom 0.254: 24.31,8.81 SP1.-
STAT  (via drill 0.25)
  Top 0.152: v10.16,10.67 12.26,10.67 13.02,9.91 R4.2 13.99,9.91 14.97,10.88 18.31,10.88 19.29,9.91 R5.1 | v6.1,10.67 5.94,10.82 4.04,10.82 v3.94,10.92 | v0.76,10.41 1.02,10.67 1.52,10.67 1.79,10.93 U7.7
  Bottom 0.152: v10.16,10.67 v6.1,10.67 | v3.94,10.92 1.27,10.92 v0.76,10.41
TX  (via drill 0.25)
  Top 0.152: v59.69,3.3 59.69,2.03 U5.40
  Bottom 0.152: JP2.8 58.29,1.91 v59.69,3.3
TXD0  (via drill 0.25)
  Top 0.152: v60.45,7.11 60.45,7.06 56.62,3.23 U5.38
  Bottom 0.152: TP4.P$1 61.21,7.87 v60.45,7.11
USB_N
  Top 0.152: J1.2 16.07,5.46 16.82,6.2 21.16,6.2 21.34,6.02 27.61,6.02 30.25,8.66 37.82,8.66 38.97,9.81 U5.22
USB_P
  Top 0.152: U5.23 39.12,8.31 38.12,7.32 37.06,7.32 36.04,8.33 30.35,8.33 27.52,5.5 27.06,5.5 26.84,5.71 26.34,5.71 26.12,5.5 21.43,5.5 21.03,5.89 20.07,5.89 19.51,5.33 18.8,5.33 18.24,5.89 17.35,5.89 J1.3
USBID  (via drill 0.25)
  Top 0.152: v38.86,1.52 39.68,1.52 U5.27
  Bottom 0.152: v38.86,1.52 38.56,1.22 20.43,1.22 J1.4
V+  (via drill 0.25)
  Top 0.254: U7.2 U7.1 4.16,14.39 4.9,13.65 C1.1 5.58,13.65 D3.C D2.C 8.31,8.38 v9.65,8.38 | v18.54,8.38 19.05,7.87 CHG.A
  Bottom 0.254: v9.65,8.38 v18.54,8.38
VBAT  (via drill 0.25)
  Top 0.254: BATTERY.2 2.29,15.57 U7.3 U7.4 | D1.C 6.35,6.86 v5.59,7.62 4.93,8.28 4.93,9.2 4.14,9.98 R2.1 R2.2 | v8.05,4.39 v8.06,4.39 U1.2 8.06,2.98 | J2.1 v23.18,11.43 23.18,16.19 v23.11,16.26 | U6.5 24.89,6.6 24.68,6.39 22.5,6.39 v22.35,6.54 | C3.2 C2.2 60.9,20.57 60.9,19.38 U5.2 61.12,17.94 v60.2,17.02 v60.2,11.94 | 8.06,2.98 7.41,2.33 U1.8 7.39,1.59 C9.1 | 8.06,2.98 8.71,2.33 U1.6 8.71,1.2 9.14,0.76 10.6,0.76 C8.1 | v22.1,4.32 23.06,3.36 26.52,3.36 30.57,7.41 33.39,7.41 34.64,6.16 34.64,5.24 35.07,4.81 R1.7 35.45,4.83 35.94,4.83 | 35.94,4.83 36.73,5.62 R1.3 v37.96,5.62 | R1.1 36.77,4 35.94,4.83
  Bottom 0.254: v8.05,4.39 8.05,5.16 v5.59,7.62 5.26,7.95 BATTERY.2 7.54,16.26 17.7,16.26 LIGHT.2 22.27,16.26 v23.11,16.26 25.15,16.26 NEOPIX.2 | v23.18,11.43 22.35,10.6 v22.35,6.54 22.1,6.29 v22.1,4.32 | 56.39,17.53 59.69,17.53 v60.2,17.02 | J3.2 43.95,18.03 | 56.39,17.53 55.88,18.03 43.95,18.03 | 43.95,18.03 40.83,18.03 C10.1 | TP3.P$1 v60.2,11.94 56.13,7.87 JP2.7 | 56.39,17.53 50.19,11.33 45.62,11.33 39.91,5.62 v37.96,5.62
VBUS
  Top 0.254: D2.A 12.8,7.59 12.8,7.16 14.69,5.27 J1.1
XTAL_N
  Top 0.152: U5.19 37.54,14.31 X1.P$2 C5.1
XTAL_P
  Top 0.152: U5.18 37.53,15.81 X1.P$1 C4.1

### Text on the board
tPlace: - | + | - | + | - | + | - | + | ~ | RESET | BOOT
bPlace: BAT- | BAT+ | SOLAR- | SOLAR+ | LIGHT- | LIGHT+ | GND | NEOPIX / POWER | NEOPIX / SIGNAL | Neopixel: IO13 / Light: IO14 / Speaker: IO17 / Speaker Enable: IO21 / USB ID: IO33 / LED: IO34 / Accessory: IO39-42,45,46 | Other Gadgets: | A0: IO5 / A1: IO1 / A2: IO2 / D0/A3: IO3 / D1/A4: IO4 / SCL: IO11 / SDA: IO12 | Sensor Board: | RX | GND | Solar Sensor Spike w/ / ESP32-S2 (Mainboard) / OSO-MISC-20-014 | 3V3 | TX | BME280 Address: 0x76 | joey castillo / @josecastillo / CC-BY-SA 4.0 / (except the bear!) | EN | IO39 / GND | IO40 / IO41 | IO45 / IO42 | 3V3 / IO46